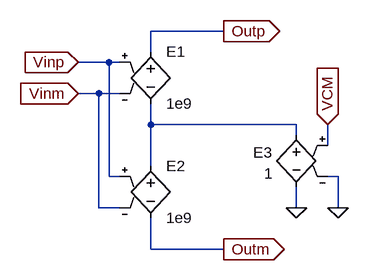
[diagram p0: schematic Ideal_differential_op_amp.asc]
Ideal_differential_op_amp.asc, the LTspice schematic file:
Version 4
SHEET 1 6300 692
WIRE 1392 336 1360 336
WIRE 1392 512 1392 336
WIRE 1408 288 1360 288
WIRE 1408 464 1408 288
WIRE 1424 288 1408 288
WIRE 1424 336 1392 336
WIRE 1424 464 1408 464
WIRE 1424 512 1392 512
WIRE 1472 272 1472 240
WIRE 1472 384 1472 352
WIRE 1472 448 1472 384
WIRE 1472 576 1472 528
WIRE 1584 240 1472 240
WIRE 1584 576 1472 576
WIRE 1696 384 1472 384
WIRE 1696 400 1696 384
WIRE 1696 512 1696 480
WIRE 1744 416 1744 384
WIRE 1760 464 1744 464
WIRE 1760 512 1760 464
FLAG 1584 240 Outp
IOPIN 1584 240 Out
FLAG 1360 288 Vinp
IOPIN 1360 288 In
FLAG 1360 336 Vinm
IOPIN 1360 336 In
FLAG 1584 576 Outm
IOPIN 1584 576 Out
FLAG 1696 512 0
FLAG 1760 512 0
FLAG 1744 384 VCM
IOPIN 1744 384 In
SYMBOL e 1696 384 M0
WINDOW 0 37 43 Left 0
WINDOW 3 36 75 Left 0
SYMATTR InstName E3
SYMATTR Value 1
SYMBOL e 1472 256 R0
SYMATTR InstName E1
SYMATTR Value 1e9
SYMBOL e 1472 432 R0
SYMATTR InstName E2
SYMATTR Value 1e9

The netlist it stands for:
* Ideal_differential_op_amp.asc
E3 N001 0 VCM 0 1
E1 Outp N001 Vinp Vinm 1e9
E2 N001 Outm Vinp Vinm 1e9
.backanno
.end